# Altium schematic sheet 03. Power.SchDoc
size A3
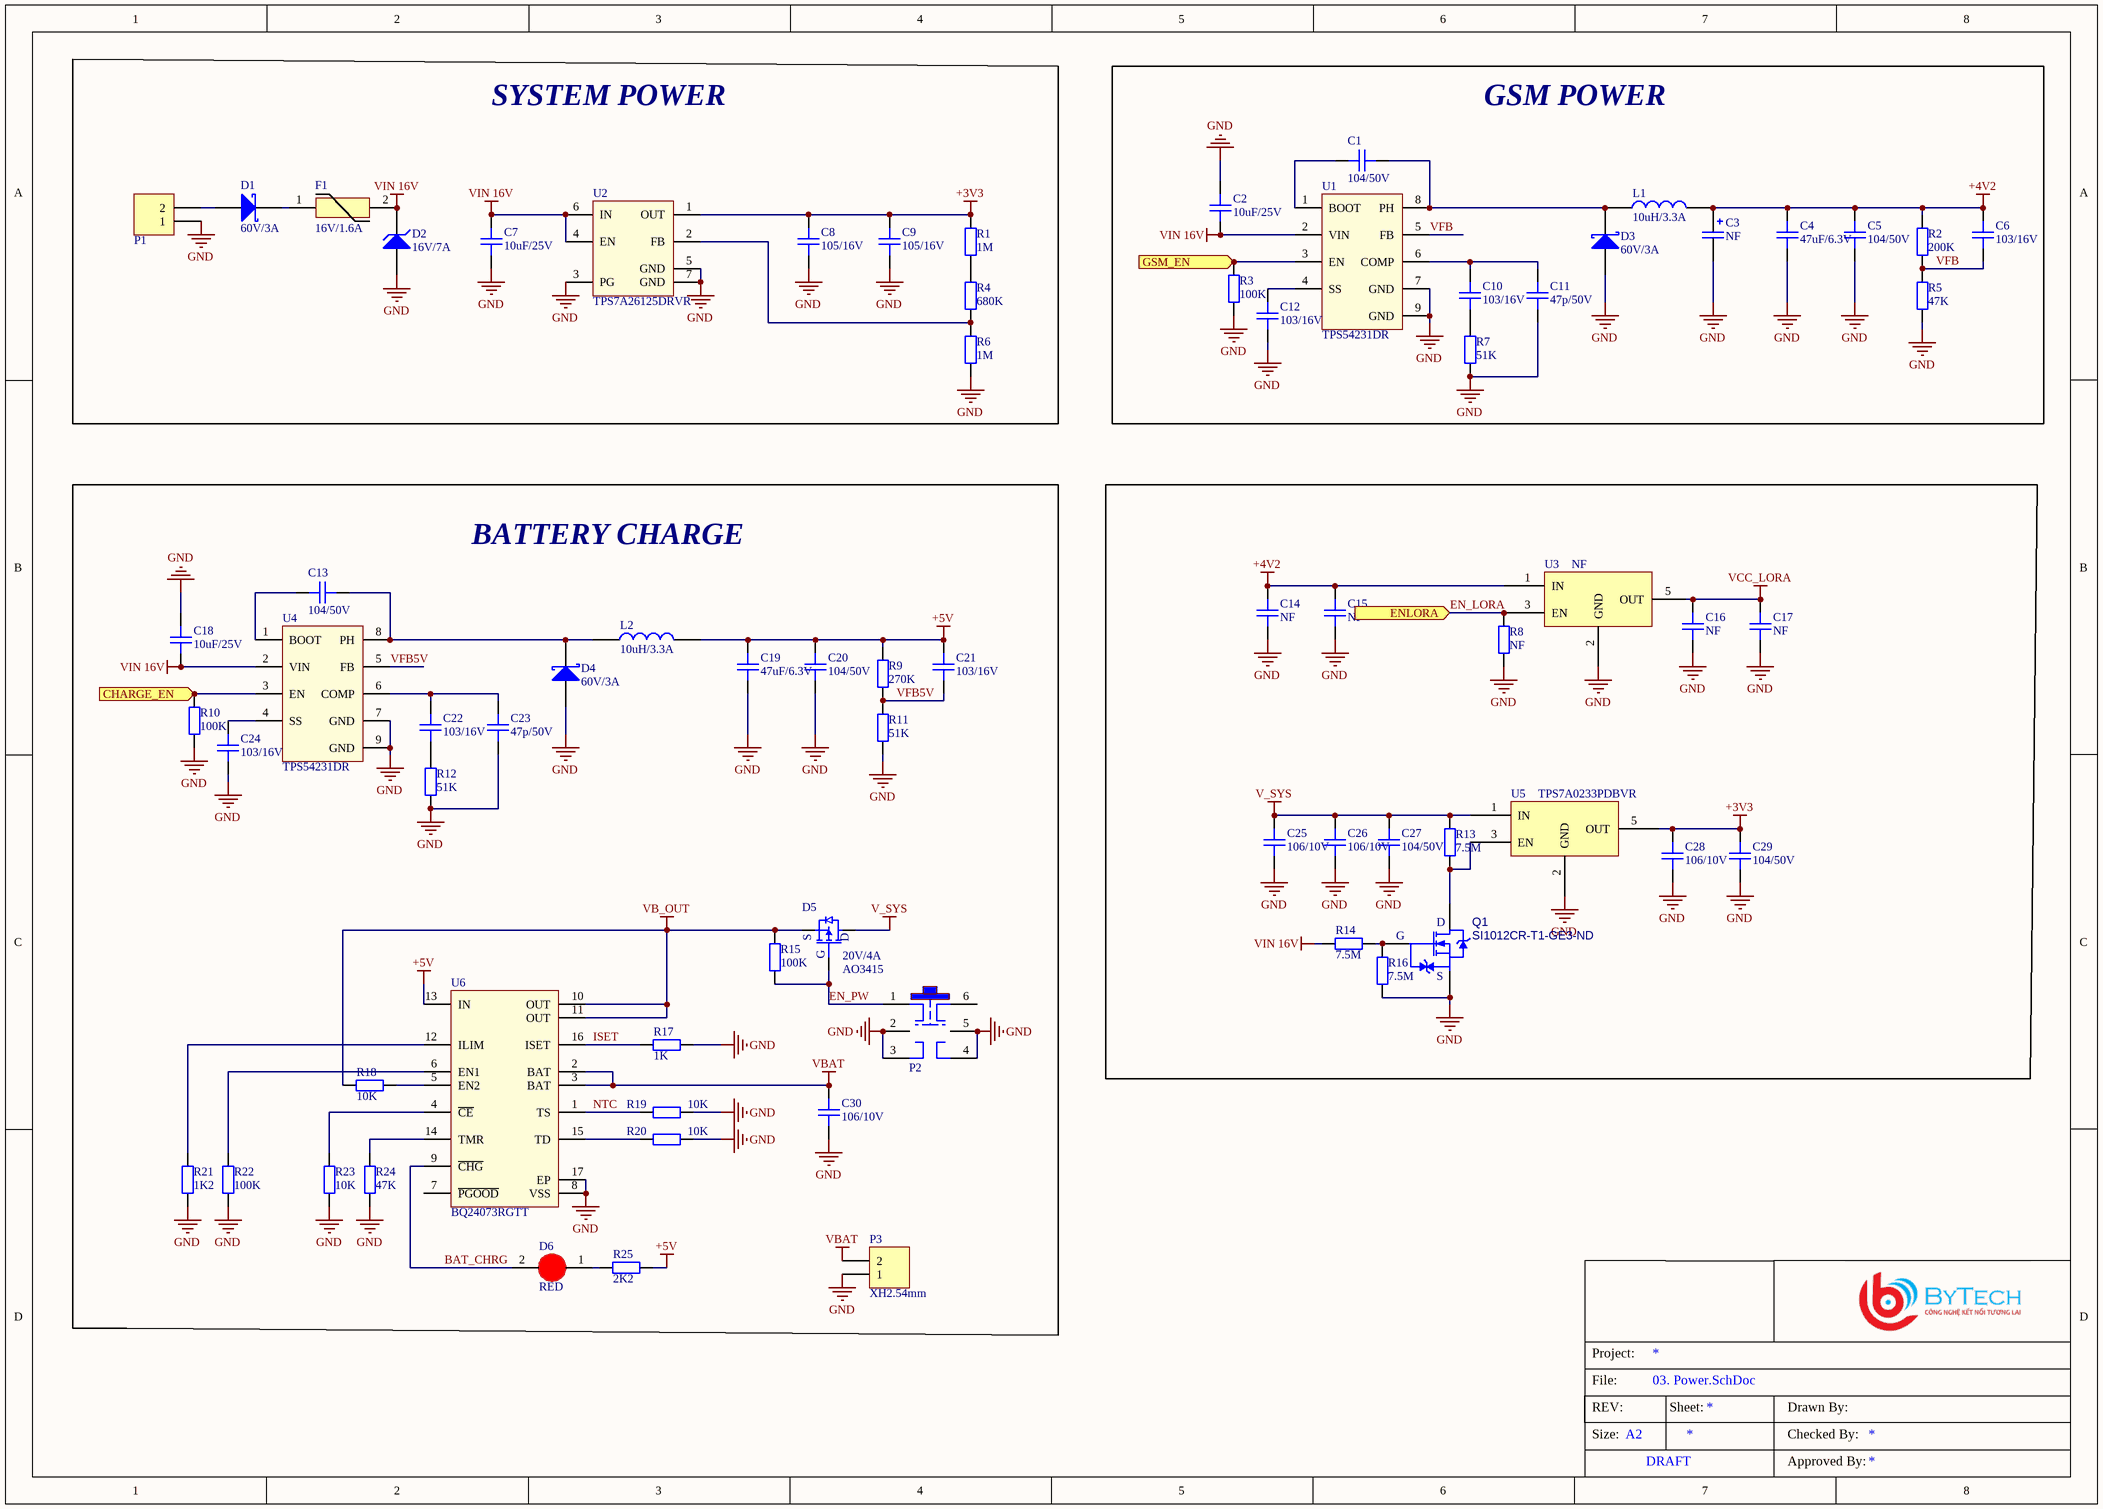
[diagram p0: 03. Power.SchDoc]

## Parts
C1  104/50V  [CAPC-0603 (1608)]
C2  10uF/25V  [CAPC-0805 (2012)]
C3  NF  [CAP_TANTAL_1210(3528)]
C4  47uF/6.3V  [CAPC-0603 (1608)]
C5  104/50V  [CAPC-0603 (1608)]
C6  103/16V  [CAPC-0603 (1608)]
C7  10uF/25V  [CAPC-0805 (2012)]
C8  105/16V  [CAPC-0603 (1608)]
C9  105/16V  [CAPC-0603 (1608)]
C10  103/16V  [CAPC-0603 (1608)]
C11  47p/50V  [CAPC-0603 (1608)]
C12  103/16V  [CAPC-0603 (1608)]
C13  104/50V  [CAPC-0603 (1608)]
C14  NF  [CAPC-0603 (1608)]
C15  NF  [CAPC-0603 (1608)]
C16  NF  [CAPC-0603 (1608)]
C17  NF  [CAPC-0603 (1608)]
C18  10uF/25V  [CAPC-0805 (2012)]
C19  47uF/6.3V  [CAPC-0603 (1608)]
C20  104/50V  [CAPC-0603 (1608)]
C21  103/16V  [CAPC-0603 (1608)]
C22  103/16V  [CAPC-0603 (1608)]
C23  47p/50V  [CAPC-0603 (1608)]
C24  103/16V  [CAPC-0603 (1608)]
C25  106/10V  [CAPC-0603 (1608)]
C26  106/10V  [CAPC-0603 (1608)]
C27  104/50V  [CAPC-0603 (1608)]
C28  106/10V  [CAPC-0603 (1608)]
C29  104/50V  [CAPC-0603 (1608)]
C30  106/10V  [CAPC-0603 (1608)]
D1  60V/3A  [DIODE_DO214AC_SMA]
D2  16V/7A  [SOD123]
D3  60V/3A  [DIODE_DO214AC_SMA]
D4  60V/3A  [DIODE_DO214AC_SMA]
D5  20V/4A  [SOT23_3]
D6  RED  [LED 0603]
F1  16V/1.6A  [FUSE_1812(4532)]
L1  10uH/3.3A  [IND-74404084150]
L2  10uH/3.3A  [IND-74404084150]
P1  15EDG3.81-2P  [HDR_3.81MM_RA_2x1]  (value not drawn)
P2  (no value)  [KFC8x8]
P3  XH2.54mm  [XH2.54-2P]
Q1  SI1012CR-T1-GE3-ND  [SOT-416]
R1  1M  [RESC-0603 (1608)]
R2  200K  [RESC-0603 (1608)]
R3  100K  [RESC-0603 (1608)]
R4  680K  [RESC-0603 (1608)]
R5  47K  [RESC-0603 (1608)]
R6  1M  [RESC-0603 (1608)]
R7  51K  [RESC-0603 (1608)]
R8  NF  [RESC-0603 (1608)]
R9  270K  [RESC-0603 (1608)]
R10  100K  [RESC-0603 (1608)]
R11  51K  [RESC-0603 (1608)]
R12  51K  [RESC-0603 (1608)]
R13  7.5M  [RESC-0603 (1608)]
R14  7.5M  [RESC-0603 (1608)]
R15  100K  [RESC-0603 (1608)]
R16  7.5M  [RESC-0603 (1608)]
R17  1K  [RESC-0603 (1608)]
R18  10K  [RESC-0603 (1608)]
R19  10K  [RESC-0603 (1608)]
R20  10K  [RESC-0603 (1608)]
R21  1K2  [RESC-0603 (1608)]
R22  100K  [RESC-0603 (1608)]
R23  10K  [RESC-0603 (1608)]
R24  47K  [RESC-0603 (1608)]
R25  2K2  [RESC-0603 (1608)]
U1  TPS54231DR  [SOIC8 - TP]
U2  TPS7A26125DRVR  [WSON6]
U3  NF  [SOT23-5]
U4  TPS54231DR  [SOIC8 - TP]
U5  TPS7A0233PDBVR  [SOT23-5]
U6  BQ24073RGTT  [RGT16-1700X1700TP]

## Blocks framed on the sheet
SYSTEM POWER: C7-C9 D1 D2 F1 P1 R1 R4 R6 U2
GSM POWER: C1-C6 C10-C12 D3 L1 R2 R3 R5 R7 U1
BATTERY CHARGE: C13 C18-C24 C30 D4-D6 L2 P2 P3 R9-R12 R15 R17-R25 U4 U6

## Ports
CHARGE_EN (in), ENLORA (in), GSM_EN (in)

## Nets
+3V3: C8.2 C9.2 C28.2 C29.2 R1.2 U2.1(OUT) U5.5(OUT)
+4V2: C3.1 C4.2 C5.2 C6.2 C14.2 C15.2 L1.2 R2.2 U3.1(IN)
+5V: C19.2 C20.2 C21.2 L2.2 R9.2 R25.2 U6.13(IN)
GND: C2.1 C3.2 C4.1 C5.1 C7.1 C8.1 C9.1 C11.1 C12.2 C14.1 C15.1 C16.1 C17.1 C18.1 C19.1 C20.1 C23.1 C24.2 C25.1 C26.1 C27.1 C28.1 C29.1 C30.1 D2.1(A) D3.1(A) D4.1(A) P1.1 P2.2 P2.3 P2.4 P2.5 P3.1 Q1.2(S) R3.1 R5.1 R6.1 R7.1 R8.1 R10.1 R11.1 R12.1 R16.1 R17.2 R19.2 R20.2 R21.1 R22.1 R23.1 R24.1 U1.7(GND) U1.9(GND) U2.3(PG) U2.5(GND) U2.7(GND) U3.2(GND) U4.7(GND) U4.9(GND) U5.2(GND) U6.8(VSS) U6.17(EP)
V_SYS: C25.2 C26.2 C27.2 D5.3(D) R13.2 U5.1(IN)
VB_OUT: D5.2(S) R15.2 R18.1 U6.10(OUT) U6.11(OUT)
VBAT: C30.2 P3.2 U6.2(BAT) U6.3(BAT)
VCC_LORA: C16.2 C17.2 U3.5(OUT)
VIN 16V: C2.2 C7.2 C18.2 D2.2(K) F1.2 R14.2 U1.2(VIN) U2.4(EN) U2.6(IN) U4.2(VIN)
BAT_CHRG: D6.2(K) U6.9(~{CHG})
CHARGE_EN: R10.2 U4.3(EN) ; port CHARGE_EN
EN_LORA: R8.2 U3.3(EN) ; port ENLORA
EN_PW: D5.1(G) P2.1 R15.1
GSM_EN: R3.2 U1.3(EN) ; port GSM_EN
ISET: R17.1 U6.16(ISET)
NTC: R19.1 U6.1(TS)
VFB: C6.1 R2.1 R5.2 U1.5(FB)
VFB5V: C21.1 R9.1 R11.2 U4.5(FB)
NetC1_1: C1.1 U1.1(BOOT)
NetC1_2: C1.2 D3.2(K) L1.1 U1.8(PH)
NetC10_1: C10.1 C11.2 U1.6(COMP)
NetC10_2: C10.2 R7.2
NetC12_1: C12.1 U1.4(SS)
NetC13_1: C13.1 U4.1(BOOT)
NetC13_2: C13.2 D4.2(K) L2.1 U4.8(PH)
NetC22_1: C22.1 C23.2 U4.6(COMP)
NetC22_2: C22.2 R12.2
NetC24_1: C24.1 U4.4(SS)
NetD1_1: D1.1(A) P1.2
NetD1_2: D1.2(K) F1.1
NetD6_1: D6.1(A) R25.1
NetQ1_1: Q1.1(G) R14.1 R16.2
NetQ1_3: Q1.3(D) R13.1 U5.3(EN)
NetR1_1: R1.1 R4.2
NetR4_1: R4.1 R6.2 U2.2(FB)
NetR18_2: R18.2 U6.5(EN2)
NetR20_1: R20.1 U6.15(TD)
NetR21_2: R21.2 U6.12(ILIM)
NetR22_2: R22.2 U6.6(EN1)
NetR23_2: R23.2 U6.4(~{CE})
NetR24_2: R24.2 U6.14(TMR)

Not connected (* = marked no-connect by the designer): P2 6; U6 7(~{PGOOD})

## Notes on the sheet
- File:
- Project:
- REV:
- Size:
- A2
- Sheet:
- Drawn By:
- Checked By:
- DRAFT
- Approved By:

## Library data of the parts
C1 C5 C13 C20 C27 C29 = C0603C104K5RACTU: CAP CER 0.1uF 50V 10% X7R 0603; CompanyID: VT-00982; Solder: SMT; MPN: C0603C104K5RACTU; Value: 104/50V; Category: CAPACITOR
C2 C7 C18 = GMC21X5R106K25NT: CAP0805 X5R 10UF 10% 25V; MFR: CAL-CHIP ELECTRONICS, INC.; Solder: SMT; Value: 10uF/25V; MPN: GMC21X5R106K25NT; Category: Capacitor
C3 = T520B227M006ATE035: CAP TANT POLY 220uF 20% 6.3V 3528 35mOhm ESR; Solder: SMT; Value: 227/6.3V; CompanyID: VT-00643; MPN: T520B227M006ATE035
C4 C19 = GRM188R60J476ME15D: CAP CER 47UF 6.3V X5R 0603; MFR: Murata Electronics; MPN: GRM188R60J476ME15D; Value: 47uF/6.3V; Category: CAPACITOR; SOLDER: CAP-0603
C6 C21 = CC0603KRX7R7BB103: CAP CER 10nF 16V 10% X7R 0603; CompanyID: VT-00592; Solder: SMT; MPN: CC0603KRX7R7BB103; Value: 103/16V; Category: CAPACITOR
C8 C9 = CC0603KRX7R7BB105: CAP CER 1uF 10% 16V X7R 0603; Solder: SMT; Company ID: VT00032; Value: 105/16V; MPN: CC0603KRX7R7BB105
C10 C12 C22 C24 = CC0603KRX7R7BB103: CAP CER 10nF 16V 10% X7R 0603; Solder: SMT; Company ID: VT00031; MPN: CC0603KRX7R7BB103; Value: 103/16V
C11 C23 = CL10C470JB8NNNC: CAP CER 47pF 5% 50V C0G/NP0 0603; Solder: SMT; MPN: CL10C470JB8NNNC; Value: 47p/50V
C14 C16 = CL10A106KP8NNNC: CAP CER 10uF 10% 10V X5R 0603; Solder: SMT; Value: 106/10V; MPN: CL10A106KP8NNNC
C15 C17 = C0603C104K5RACTU: CAP CER 0.1uF 50V 10% X7R 0603; CompanyID: VT-00982; Solder: SMT; Value: 104/50V; MPN: C0603C104K5RACTU; Category: CAPACITOR
C25 C26 C28 = CL10A106KP8NNNC: CAP CER 10uF 10% 10V X5R 0603; Solder: SMT; MPN: CL10A106KP8NNNC; Value: 106/10V
C30 = CL10A106KP8NNNC: CAP CER 10uF 10% 10V X5R 0603; CompanyID: VT-00984; Solder: SMT; MPN: CL10A106KP8NNNC; Value: 106/10V
D1 = SK36A-LTP: DIODE SCHOTTKY 60V 3A DO214AC; MPN: SK36A-LTP; Category: Diode; Solder: DO214AC; Value: 60V/3A
D2 = 1SMF16BT3: TVS DIODE 16VWM 26VC SOD123FL; MFR: ON Semiconductor; Solder: SOD-123FL; MPN: 1SMF16BT3; Value: 16V/7A; Category: DIODE
D3 D4 = SK36A-LTP: DIODE SCHOTTKY 60V 3A DO214AC; Manufacturer: Micro Commercial Co; MPN: SK36A-LTP; Category: Diode; Solder: DO214AC; Value: 60V/3A
D5 = AO3415: MOSFET P-CH 20V 4A SOT23; MFR: Alpha & Omega Semiconductor Inc.; Company ID: VT00490; CATEGORY: DIODE; SOLDER: SOT23; VALUE: 20V/4A; MPN: AO3415
D6 = LED 0603 RED: Solder: 0603; Company ID: VT00361; MPN: LED 0603 RED; Category: LED Diode; Value: RED
F1 = MPTS1812L16016R: PTC RESET FUSE 16V 1.6A 1812; MFR: Meritek; MPN: MPTS1812L16016R; Solder: SMT 1812; Value: 16V/1.6A
L1 L2 = SWPA8040S100MT: FIXED IND 10UH 3.3A 38 MOHM SMD; MFR: Shenzhen Sunlord Electronics Co., Ltd.; DCR: 38mOhm; MPN: SWPA8040S100MT; VALUE: 10uH/3.3A; CATEGORY: INDUCTOR
P1 = 15EDG3.81-2P: Pluggable terminal 15EDG- 2P 3.81MM; MFR: China; Solder: Hand; MPN: 15EDG3.81-2P; Value: 15EDG3.81-2P; Company ID: *; MPN2: CLA5048
P2 = KFC8X8: Self-locking button 6p 8x8mm; MFR: China; Solder: Wave; MPN: KFC8X8; Category: Button; URL: http://linhkienchatluong.vn/cac-loai-khac/nut-nhan-8x8mm-6-chan-nhan-giu_sp695_ct1851.aspx; URL2: https://detail.tmall.com/item.htm?spm=a230r.1.14.19.6b277f95Qx3STz&id=576968696503&ns=1&abbucket=2
P3 = XH-2A: XH2.54mmm - 2P 180 degree; MPN: XH-2A; Value: XH2.54mm
Q1 = SI1012CR-T1-GE3-ND: MOSFET N-CH 20V 0.63A SC-75A; Solder: SMT; MPN: SI1012CR-T1-GE3-ND; Value: SI1012CR-T1-GE3-ND
R1 R6 = CRCW06031M00FKEA: RES SMD 1M OHM 1% 1/10W 0603; Solder: SMT; Company ID: VT00405; MPN: CRCW06031M00FKEA; Value: 1M
R2 = CR0603-FX-2003ELF: RES SMD 200K OHM 1% 1/10W 0603; MPN: CR0603-FX-2003ELF; VALUE: 200K; Category: Resistor
R3 R8 R10 R15 = RC0603FR-07100KL: RES SMD 100K OHM 1% 1/10W 0603; Solder: SMT; Company ID: VT00424; MPN: RC0603FR-07100KL; Value: 100K
R4 = RT0603FRE07680KL: RES SMD 680K OHM 1% 1/10W 0603; MFR: YAGEO; Solder: SMT; MPN: RT0603FRE07680KL; Value: 680K
R5 = RC0603FR0747KL: RES SMD 47K OHM 1% 1/10W 0603; Solder: SMT; Value: 47K; MPN: RC0603FR0747KL
R7 R11 R12 = RC0603FR-0751KL: RES SMD 51K OHM 1% 1/10W 0603; MFR: Yageo; Company ID: VT00453; Value: 51K; Category: Resistor; MPN: RC0603FR-0751KL; Solder: RES-0603
R9 = RT0603BRD07270KL: RES SMD 270K OHM 0.1% 1/10W 0603; Company ID: VT00474; value: 270K; MPN: RT0603BRD07270KL
R13 R14 R16 = RC0603FR-077M5L: RES SMD 7.5M OHM 1% 1/10W 0603; Solder: SMT; MPN: RC0603FR-077M5L; Value: 7.5M
R17 = RC0603FR-071KL: RES SMD 1 KOHM 1% 1/10W 0603; Solder: SMT; Company ID: VT00433; MPN: RC0603FR-071KL; Value: 1K
R18-R20 R23 = RC0603FR-0710KL: RES SMD 10K OHM 1% 1/10W 0603; CompanyID: VT-00328; Solder: SMT; MPN: RC0603FR-0710KL; Value: 10K
R21 = RC0603FR-071K2L: RES SMD 1.2K OHM 1% 1/10W 0603; CompanyID: VT-01075; Solder: SMT; Value: 1K2; MPN: RC0603FR-071K2L
R22 = RC0603FR-07100KL: RES SMD 100K OHM 1% 1/10W 0603; Solder: SMT; CompanyID: VT-00332; MPN: RC0603FR-07100KL; Value: 100K
R24 = RC0603FR0747KL: RES SMD 47K OHM 1% 1/10W 0603; CompanyID: VT-00322; Solder: SMT; Value: 47K; MPN: RC0603FR0747KL
R25 = CRCW06032K20FKEA: RES SMD 2.2K OHM 1% 1/10W 0603; Solder: SMT; Company ID: VT00406; MPN: CRCW06032K20FKEA; Value: 2K2
U1 U4 = TPS54231DR: IC REG BUCK ADJUSTABLE 2A 8SOIC; MFR: TI; SOLDER: SOIC8; MPN: TPS54231DR; CATEGORY: IC; VALUE: TPS54231DR
U2 = TPS7A26125DRVR: IC REG LINEAR 1.25V 500MA 6WSON; MFR: TI; MPN: TPS7A26125DRVR; CATEGORY: IC; VALUE: TPS7A26125DRVR; SOLDER: 6WSON; Company ID: *
U3 U5 = TPS7A0233PDBVR: NANOPOWER LDO; Current - Quiescent: 60nA; MPN: TPS7A0233PDBVR; Category: IC; Solder: SOT23-5; Value: TPS7A0233PDBVR
U6 = BQ24073RGTT: IC LI-ION CHARGE/PWR MGMT 16-QFN; MFR: Texas Instruments; Solder: 16-QFN (3x3); Company ID: VT00206; MPN: BQ24073RGTT; Category: IC; Value: BQ24073RGTT